# Altium schematic sheet GD2.SchDoc
size A2; SheetNumber: 1; SheetTotal: 1
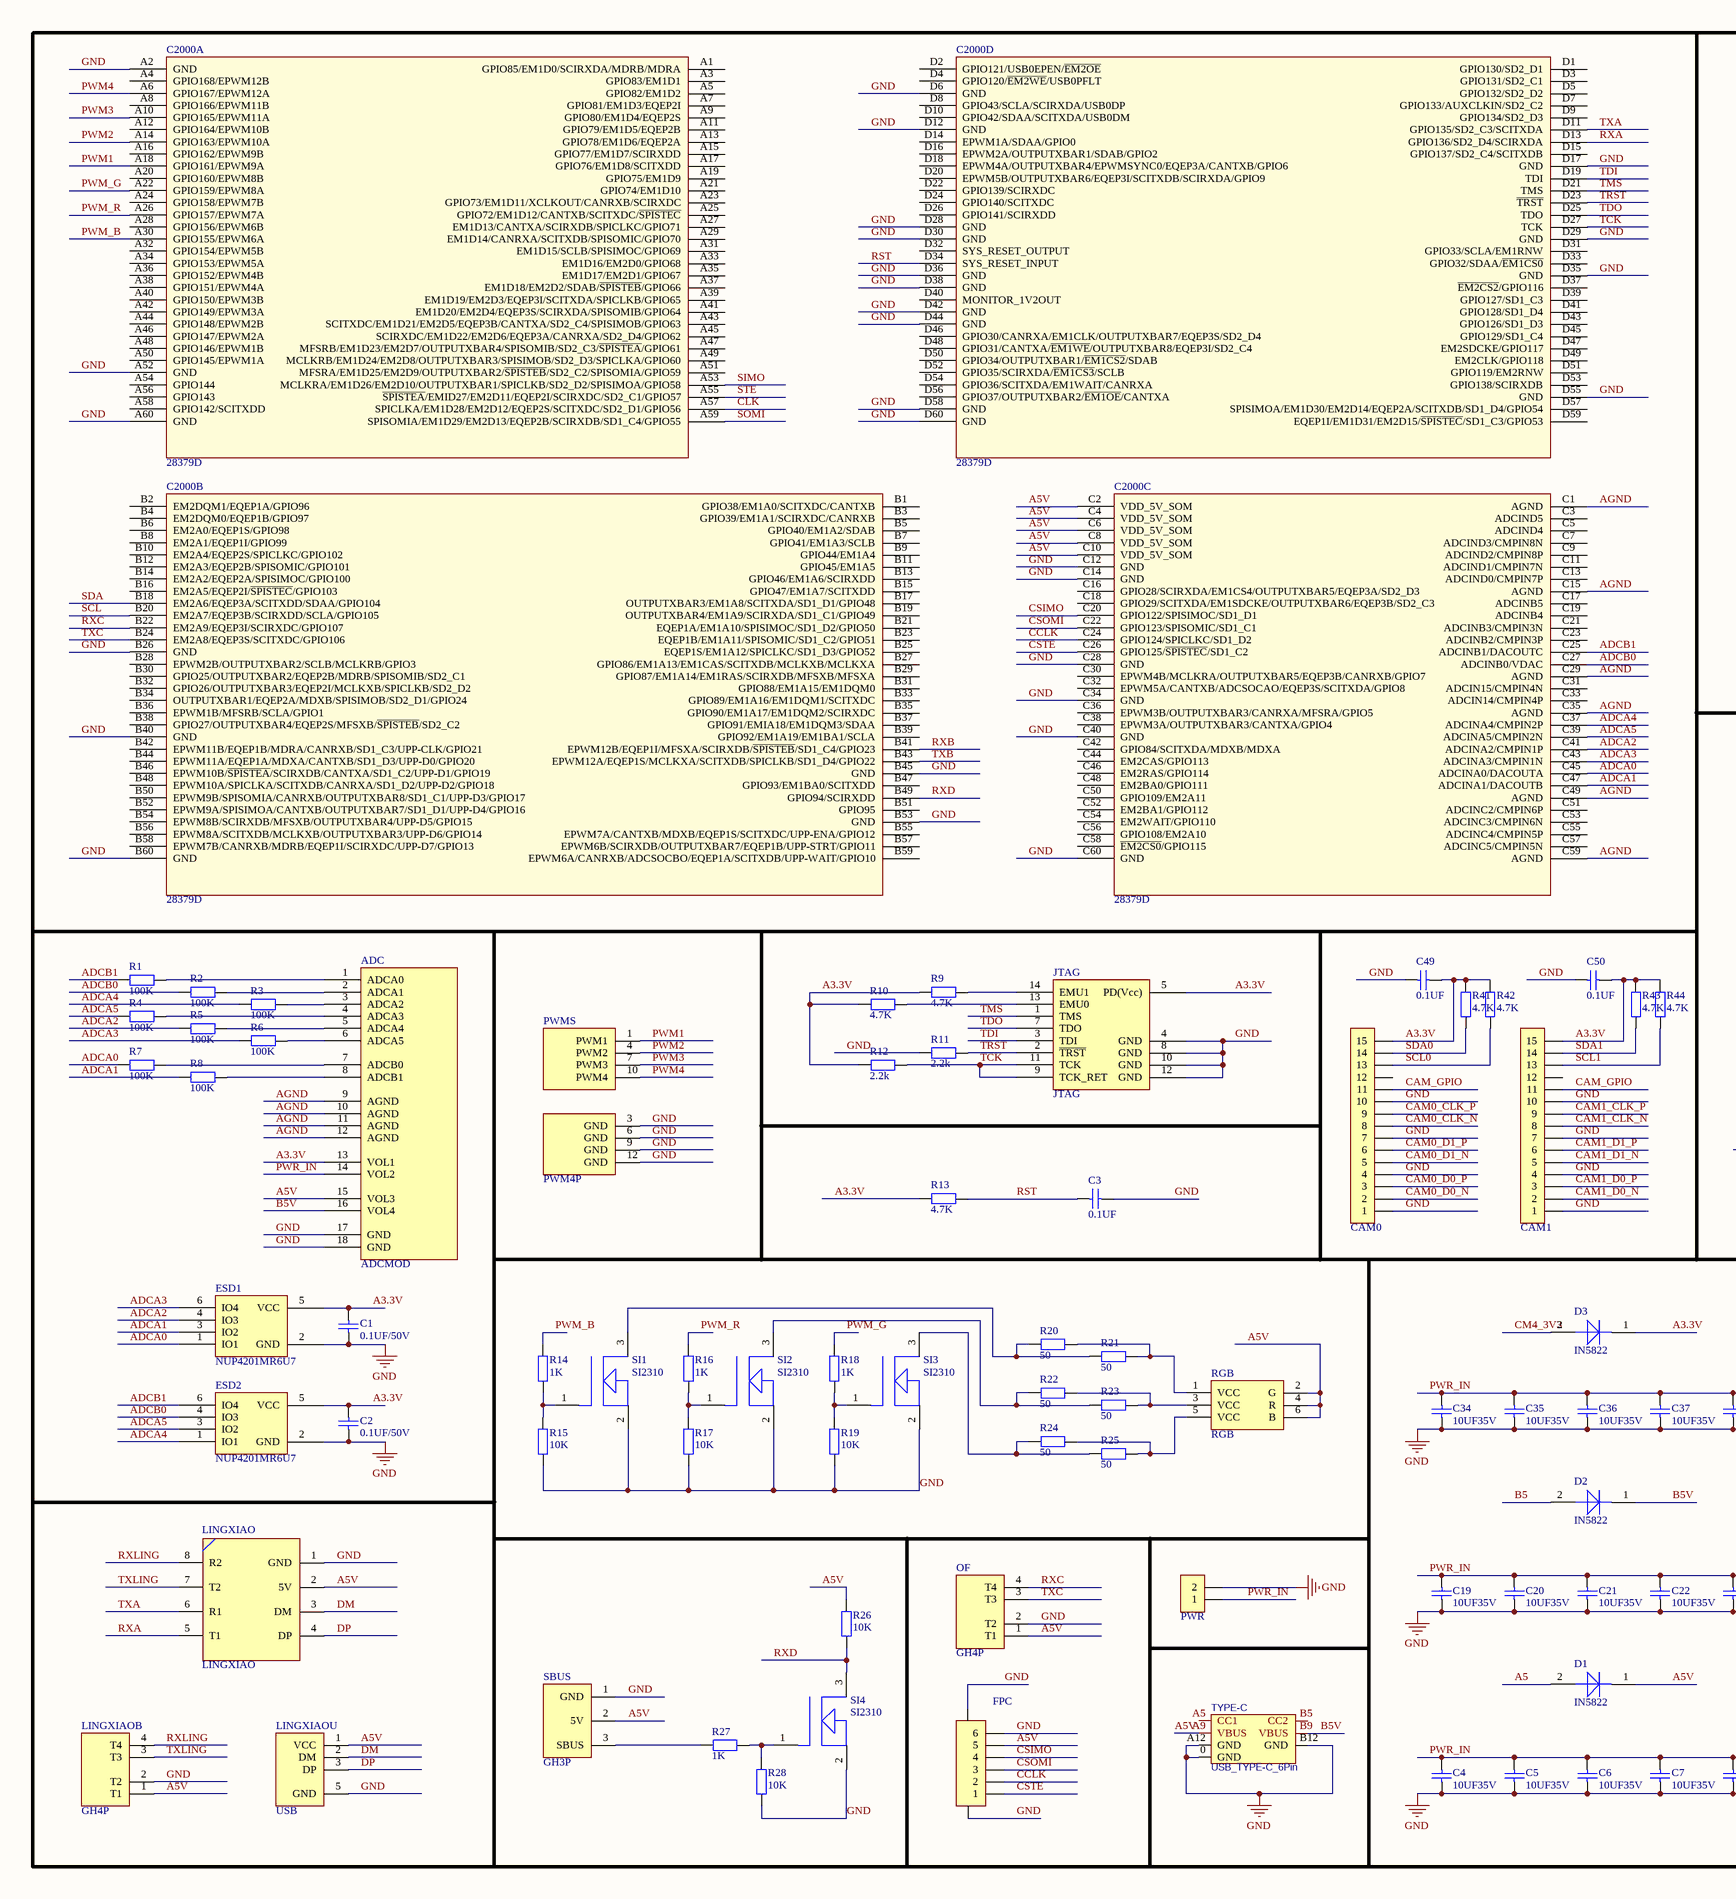
[diagram p0: GD2.SchDoc, left]
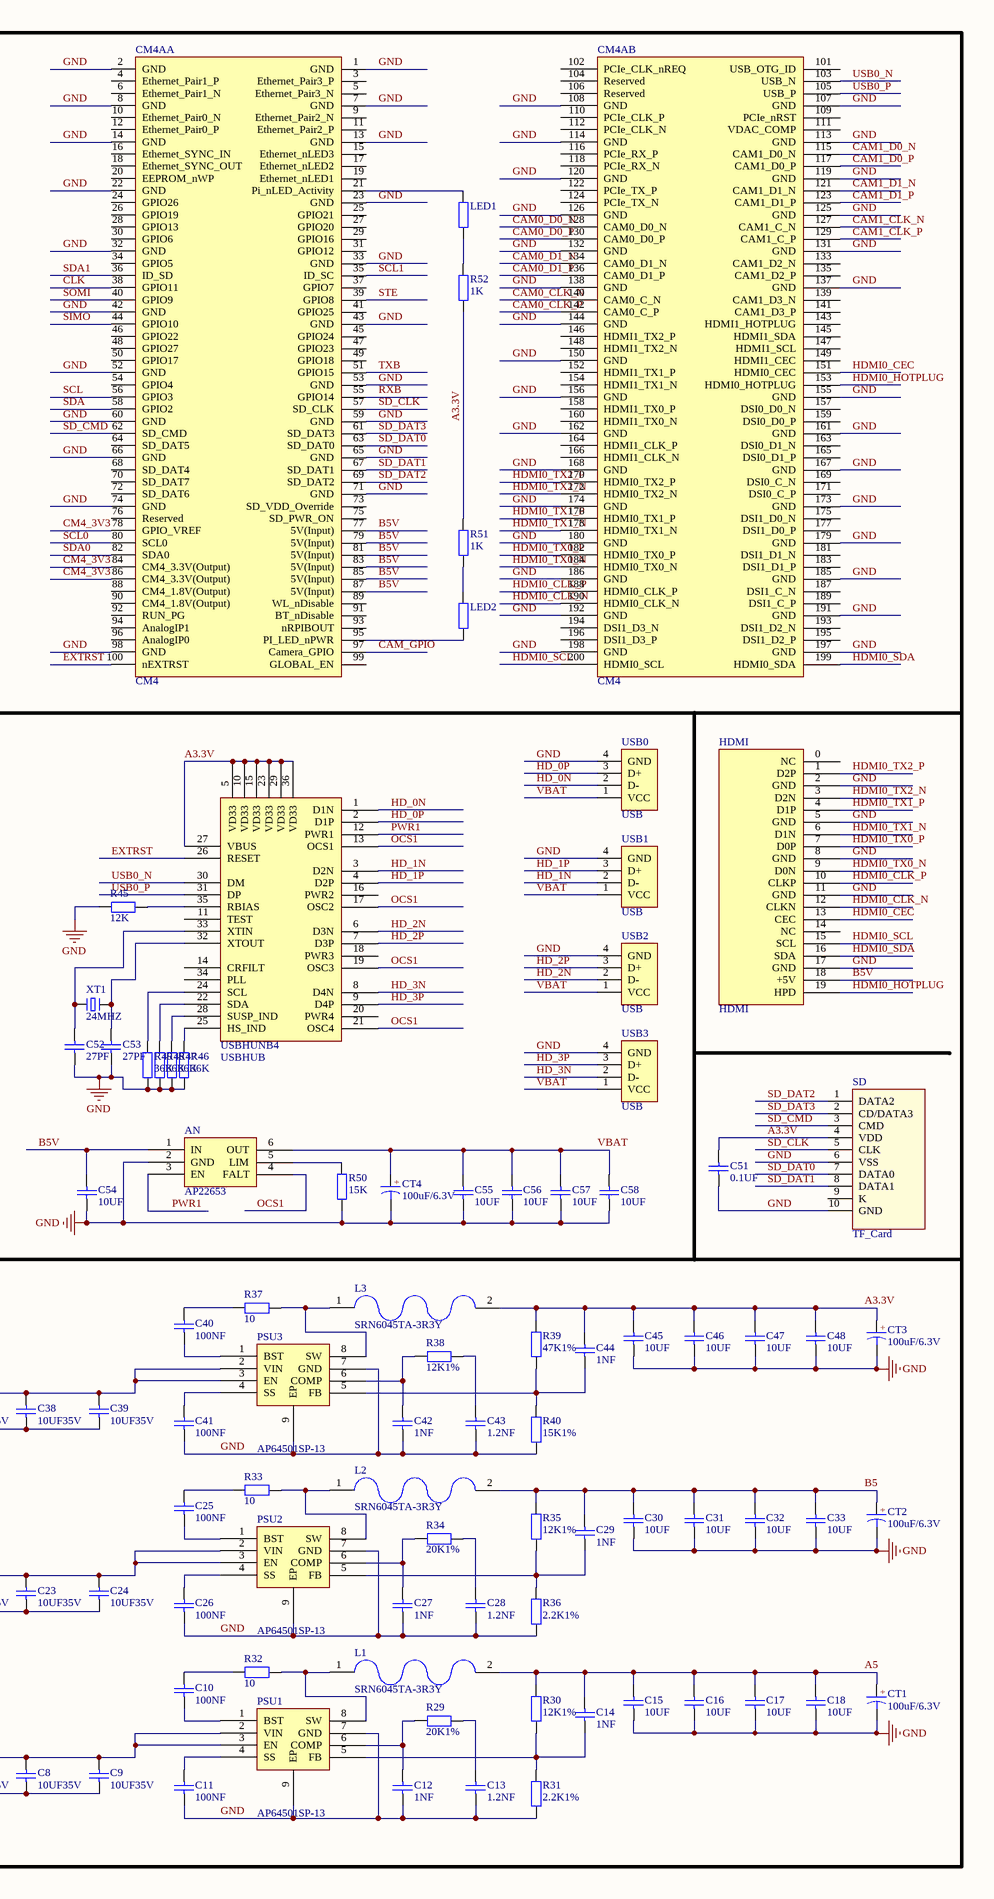
[diagram p1: GD2.SchDoc, right]

## Parts
ADC  ADCMOD  [ADCMOD]
AN  AP22653  [SOT23-6]
C1  0.1UF/50V  [C0603_L]
C2  0.1UF/50V  [C0603_L]
C3  0.1UF  [C0603_L]
C4  10UF35V  [C0603_L]
C5  10UF35V  [C0603_L]
C6  10UF35V  [C0603_L]
C7  10UF35V  [C0603_L]
C8  10UF35V  [C0603_L]
C9  10UF35V  [C0603_L]
C10  100NF  [C0603_L]
C11  100NF  [C0603_L]
C12  1NF  [C0603_L]
C13  1.2NF  [C0603_L]
C14  1NF  [C0603_L]
C15  10UF  [C0603_L]
C16  10UF  [C0603_L]
C17  10UF  [C0603_L]
C18  10UF  [C0603_L]
C19  10UF35V  [C0603_L]
C20  10UF35V  [C0603_L]
C21  10UF35V  [C0603_L]
C22  10UF35V  [C0603_L]
C23  10UF35V  [C0603_L]
C24  10UF35V  [C0603_L]
C25  100NF  [C0603_L]
C26  100NF  [C0603_L]
C27  1NF  [C0603_L]
C28  1.2NF  [C0603_L]
C29  1NF  [C0603_L]
C30  10UF  [C0603_L]
C31  10UF  [C0603_L]
C32  10UF  [C0603_L]
C33  10UF  [C0603_L]
C34  10UF35V  [C0603_L]
C35  10UF35V  [C0603_L]
C36  10UF35V  [C0603_L]
C37  10UF35V  [C0603_L]
C38  10UF35V  [C0603_L]
C39  10UF35V  [C0603_L]
C40  100NF  [C0603_L]
C41  100NF  [C0603_L]
C42  1NF  [C0603_L]
C43  1.2NF  [C0603_L]
C44  1NF  [C0603_L]
C45  10UF  [C0603_L]
C46  10UF  [C0603_L]
C47  10UF  [C0603_L]
C48  10UF  [C0603_L]
C49  0.1UF  [C0603_L]
C50  0.1UF  [C0603_L]
C51  0.1UF  [C0603_L]
C52  27PF  [C0603_L]
C53  27PF  [C0603_L]
C54  10UF  [C0603_L]
C55  10UF  [C0603_L]
C56  10UF  [C0603_L]
C57  10UF  [C0603_L]
C58  10UF  [C0603_L]
C2000  28379D  [28379D]  (parts A,B,C,D of 4)
CAM0  CON-15P  [FPC1.0-WT-15P]  (value not drawn)
CAM1  CON-15P  [FPC1.0-WT-15P]  (value not drawn)
CM4A  CM4  [CM4]  (parts A,B of 2)
CT1  100uF/6.3V  [C_3216]
CT2  100uF/6.3V  [C_3216]
CT3  100uF/6.3V  [C_3216]
CT4  100uF/6.3V  [C_3216]
D1  IN5822  [IN5819]
D2  IN5822  [IN5819]
D3  IN5822  [IN5819]
ESD1  NUP4201MR6U7  [TSOP-6]
ESD2  NUP4201MR6U7  [TSOP-6]
FPC  CON-6P  [FPC1.0-WT-6P]  (value not drawn)
HDMI  HDMI  [HDMI_A]
JTAG  JTAG  [JTAG]
L1  SRN6045TA-3R3Y  [CD42]
L2  SRN6045TA-3R3Y  [CD42]
L3  SRN6045TA-3R3Y  [CD42]
LED1  (no value)  [R0805_L]
LED2  (no value)  [R0805_L]
LINGXIAO  LINGXIAO  [LINGXIAO]
LINGXIAOB  GH4P  [GH4P]
LINGXIAOU  USB  [USB]
OF  GH4P  [GH4P]
PSU1  AP64501SP-13  [SOIP-8]
PSU2  AP64501SP-13  [SOIP-8]
PSU3  AP64501SP-13  [SOIP-8]
PWMS  PWM4P  [PWM4P]
PWR  HDR-1X2  [KF2EDGK5.08-WI-2P]  (value not drawn)
R1  100K  [R0603_L]
R2  100K  [R0603_L]
R3  100K  [R0603_L]
R4  100K  [R0603_L]
R5  100K  [R0603_L]
R6  100K  [R0603_L]
R7  100K  [R0603_L]
R8  100K  [R0603_L]
R9  4.7K  [R0603_L]
R10  4.7K  [R0603_L]
R11  2.2k  [R0603_L]
R12  2.2k  [R0603_L]
R13  4.7K  [R0603_L]
R14  1K  [R0603_L]
R15  10K  [R0603_L]
R16  1K  [R0603_L]
R17  10K  [R0603_L]
R18  1K  [R0603_L]
R19  10K  [R0603_L]
R20  50  [R0603_L]
R21  50  [R0603_L]
R22  50  [R0603_L]
R23  50  [R0603_L]
R24  50  [R0603_L]
R25  50  [R0603_L]
R26  10K  [R0603_L]
R27  1K  [R0603_L]
R28  10K  [R0603_L]
R29  20K1%  [R0603_L]
R30  12K1%  [R0603_L]
R31  2.2K1%  [R0603_L]
R32  10  [R0603_L]
R33  10  [R0603_L]
R34  20K1%  [R0603_L]
R35  12K1%  [R0603_L]
R36  2.2K1%  [R0603_L]
R37  10  [R0603_L]
R38  12K1%  [R0603_L]
R39  47K1%  [R0603_L]
R40  15K1%  [R0603_L]
R41  4.7K  [R0603_L]
R42  4.7K  [R0603_L]
R43  4.7K  [R0603_L]
R44  4.7K  [R0603_L]
R45  12K  [R0603_L]
R46  36K  [R0603_L]
R47  36K  [R0603_L]
R48  36K  [R0603_L]
R49  36K  [R0603_L]
R50  15K  [R0603_L]
R51  1K  [R0603_L]
R52  1K  [R0603_L]
RGB  RGB  [RGB]
SBUS  GH3P  [GH3P]
SD  TF_Card  [Micro SD]
SI1  SI2310  [SI2310]
SI2  SI2310  [SI2310]
SI3  SI2310  [SI2310]
SI4  SI2310  [SI2310]
TYPE-C  USB_TYPE-C_6Pin  [USB-C-SMD_6P]
USB0  USB  [USB2.0_Type-A_DIP_F_1]
USB1  USB  [USB2.0_Type-A_DIP_F_1]
USB2  USB  [USB2.0_Type-A_DIP_F_1]
USB3  USB  [USB2.0_Type-A_DIP_F_1]
USBHUNB4  USBHUB  [QFN36]
XT1  24MHZ  [XTAL-5032-2P]

## Nets
GND: ADC.17(GND) ADC.18(GND) AN.2(GND) C1.1 C2.1 C3.1 C4.1 C5.1 C6.1 C7.1 C8.1 C9.1 C11.1 C12.1 C13.1 C15.1 C16.1 C17.1 C18.1 C19.1 C20.1 C21.1 C22.1 C23.1 C24.1 C26.1 C27.1 C28.1 C30.1 C31.1 C32.1 C33.1 C34.1 C35.1 C36.1 C37.1 C38.1 C39.1 C41.1 C42.1 C43.1 C45.1 C46.1 C47.1 C48.1 C49.2 C50.2 C51.1 C52.1 C53.1 C54.1 C55.1 C56.1 C57.1 C58.1 C2000.A2(GND) C2000.A52(GND) C2000.A60(GND) C2000.B26(GND) C2000.B40(GND) C2000.B45(GND) C2000.B53(GND) C2000.B60(GND) C2000.C12(GND) C2000.C14(GND) C2000.C28(GND) C2000.C34(GND) C2000.C40(GND) C2000.C60(GND) C2000.D6(GND) C2000.D12(GND) C2000.D17(GND) C2000.D28(GND) C2000.D29(GND) C2000.D30(GND) C2000.D35(GND) C2000.D36(GND) C2000.D38(GND) C2000.D42(GND) C2000.D44(GND) C2000.D55(GND) C2000.D58(GND) C2000.D60(GND) CAM0.1 CAM0.4 CAM0.7 CAM0.10 CAM1.1 CAM1.4 CAM1.7 CAM1.10 CM4A.1(GND) CM4A.2(GND) CM4A.7(GND) CM4A.8(GND) CM4A.13(GND) CM4A.14(GND) CM4A.22(GND) CM4A.23(GND) CM4A.32(GND) CM4A.33(GND) CM4A.42(GND) CM4A.43(GND) CM4A.52(GND) CM4A.53(GND) CM4A.59(GND) CM4A.60(GND) CM4A.65(GND) CM4A.66(GND) CM4A.71(GND) CM4A.74(GND) CM4A.98(GND) CM4A.107(GND) CM4A.108(GND) CM4A.113(GND) CM4A.114(GND) CM4A.119(GND) CM4A.120(GND) CM4A.125(GND) CM4A.126(GND) CM4A.131(GND) CM4A.132(GND) CM4A.137(GND) CM4A.138(GND) CM4A.144(GND) CM4A.150(GND) CM4A.155(GND) CM4A.156(GND) CM4A.161(GND) CM4A.162(GND) CM4A.167(GND) CM4A.168(GND) CM4A.173(GND) CM4A.174(GND) CM4A.179(GND) CM4A.180(GND) CM4A.185(GND) CM4A.186(GND) CM4A.191(GND) CM4A.192(GND) CM4A.197(GND) CM4A.198(GND) CT1.2(K) CT2.2(K) CT3.2(K) CT4.2(K) ESD1.2(GND) ESD2.2(GND) FPC.0 FPC.6 HDMI.2(GND) HDMI.5(GND) HDMI.8(GND) HDMI.11(GND) HDMI.17(GND) JTAG.4(GND) JTAG.8(GND) JTAG.10(GND) JTAG.12(GND) LINGXIAO.1(GND) LINGXIAOB.2(T2) LINGXIAOU.5(GND) OF.2(T2) PSU1.7(GND) PSU1.9(EP) PSU2.7(GND) PSU2.9(EP) PSU3.7(GND) PSU3.9(EP) PWMS.3(GND) PWMS.6(GND) PWMS.9(GND) PWMS.12(GND) PWR.2 R11.1 R15.1 R17.1 R19.1 R28.2 R31.1 R36.1 R40.1 R45.1 R46.1 R47.1 R48.1 R49.1 R50.1 SBUS.1(GND) SD.6(VSS) SD.10(GND) SI1.2(B) SI2.2(B) SI3.2(B) SI4.2(B) TYPE-C.0(GND) TYPE-C.A12(GND) TYPE-C.B12(GND) USB0.4(GND) USB1.4(GND) USB2.4(GND) USB3.4(GND)
A3.3V: ADC.13(VOL1) C1.2 C2.2 C44.2 C45.2 C46.2 C47.2 C48.2 C49.1 C50.1 C51.2 CAM0.15 CAM1.15 CT3.1(A) D3.1(T1) ESD1.5(VCC) ESD2.5(VCC) JTAG.5(PD(Vcc)) L3.2(T3) R9.1 R10.1 R12.1 R13.2 R39.2 R41.2 R42.2 R43.2 R44.2 R51.2 R52.1 SD.4(VDD) USBHUNB4.5(VD33) USBHUNB4.10(VD33) USBHUNB4.15(VD33) USBHUNB4.23(VD33) USBHUNB4.27(VBUS) USBHUNB4.29(VD33) USBHUNB4.36(VD33)
A5: C14.2 C15.2 C16.2 C17.2 C18.2 CT1.1(A) D1.2(T2) L1.2(T3) R30.2
A5V: ADC.15(VOL3) C2000.C2(VDD_5V_SOM) C2000.C4(VDD_5V_SOM) C2000.C6(VDD_5V_SOM) C2000.C8(VDD_5V_SOM) C2000.C10(VDD_5V_SOM) D1.1(T1) FPC.5 LINGXIAO.2(5V) LINGXIAOB.1(T1) LINGXIAOU.1(VCC) OF.1(T1) R26.2 RGB.2(G) RGB.4(R) RGB.6(B) SBUS.2(5V) TYPE-C.A9(VBUS)
ADCA0: C2000.C45(ADCINA0/DACOUTA) ESD1.1(IO1) R7.1
ADCA1: C2000.C47(ADCINA1/DACOUTB) ESD1.3(IO2) R8.1
ADCA2: C2000.C41(ADCINA2/CMPIN1P) ESD1.4(IO3) R5.1
ADCA3: C2000.C43(ADCINA3/CMPIN1N) ESD1.6(IO4) R6.1
ADCA4: C2000.C37(ADCINA4/CMPIN2P) ESD2.1(IO1) R3.1
ADCA5: C2000.C39(ADCINA5/CMPIN2N) ESD2.3(IO2) R4.1
ADCB0: C2000.C27(ADCINB0/VDAC) ESD2.4(IO3) R2.1
ADCB1: C2000.C25(ADCINB1/DACOUTC) ESD2.6(IO4) R1.1
AGND: ADC.9(AGND) ADC.10(AGND) ADC.11(AGND) ADC.12(AGND) C2000.C1(AGND) C2000.C15(AGND) C2000.C29(AGND) C2000.C35(AGND) C2000.C49(AGND) C2000.C59(AGND)
B5: C29.2 C30.2 C31.2 C32.2 C33.2 CT2.1(A) D2.2(T2) L2.2(T3) R35.2
B5V: ADC.16(VOL4) AN.1(IN) C54.2 CM4A.77(5V(Input)) CM4A.79(5V(Input)) CM4A.81(5V(Input)) CM4A.83(5V(Input)) CM4A.85(5V(Input)) CM4A.87(5V(Input)) D2.1(T1) HDMI.18(+5V) TYPE-C.B9(VBUS)
CAM0_CLK_N: CAM0.8 CM4A.140(CAM0_C_N)
CAM0_CLK_P: CAM0.9 CM4A.142(CAM0_C_P)
CAM0_D0_N: CAM0.2 CM4A.128(CAM0_D0_N)
CAM0_D0_P: CAM0.3 CM4A.130(CAM0_D0_P)
CAM0_D1_N: CAM0.5 CM4A.134(CAM0_D1_N)
CAM0_D1_P: CAM0.6 CM4A.136(CAM0_D1_P)
CAM1_CLK_N: CAM1.8 CM4A.127(CAM1_C_N)
CAM1_CLK_P: CAM1.9 CM4A.129(CAM1_C_P)
CAM1_D0_N: CAM1.2 CM4A.115(CAM1_D0_N)
CAM1_D0_P: CAM1.3 CM4A.117(CAM1_D0_P)
CAM1_D1_N: CAM1.5 CM4A.121(CAM1_D1_N)
CAM1_D1_P: CAM1.6 CM4A.123(CAM1_D1_P)
CAM_GPIO: CAM0.11 CAM1.11 CM4A.97(Camera_GPIO)
CCLK: C2000.C24(GPIO124/SPICLKC/SD1_D2) FPC.2
CLK: C2000.A57(SPICLKA/EM1D28/EM2D12/EQEP2S/SCITXDC/SD2_D1/GPIO56) CM4A.38(GPIO11)
CM4_3V3: CM4A.78(GPIO_VREF) CM4A.84(CM4_3.3V(Output)) CM4A.86(CM4_3.3V(Output)) D3.2(T2)
CSIMO: C2000.C20(GPIO122/SPISIMOC/SD1_D1) FPC.4
CSOMI: C2000.C22(GPIO123/SPISOMIC/SD1_C1) FPC.3
CSTE: C2000.C26(GPIO125/~{SPISTEC}/SD1_C2) FPC.1
DM: LINGXIAO.3(DM) LINGXIAOU.2(DM)
DP: LINGXIAO.4(DP) LINGXIAOU.3(DP)
EXTRST: CM4A.100(nEXTRST) USBHUNB4.26(RESET)
HD_0N: USB0.2(D-) USBHUNB4.1(D1N)
HD_0P: USB0.3(D+) USBHUNB4.2(D1P)
HD_1N: USB1.2(D-) USBHUNB4.3(D2N)
HD_1P: USB1.3(D+) USBHUNB4.4(D2P)
HD_2N: USB2.2(D-) USBHUNB4.6(D3N)
HD_2P: USB2.3(D+) USBHUNB4.7(D3P)
HD_3N: USB3.2(D-) USBHUNB4.8(D4N)
HD_3P: USB3.3(D+) USBHUNB4.9(D4P)
HDMI0_CEC: CM4A.151(HDMI0_CEC) HDMI.13(CEC)
HDMI0_CLK_N: CM4A.190(HDMI0_CLK_N) HDMI.12(CLKN)
HDMI0_CLK_P: CM4A.188(HDMI0_CLK_P) HDMI.10(CLKP)
HDMI0_HOTPLUG: CM4A.153(HDMI0_HOTPLUG) HDMI.19(HPD)
HDMI0_SCL: CM4A.200(HDMI0_SCL) HDMI.15(SCL)
HDMI0_SDA: CM4A.199(HDMI0_SDA) HDMI.16(SDA)
HDMI0_TX0_N: CM4A.184(HDMI0_TX0_N) HDMI.9(D0N)
HDMI0_TX0_P: CM4A.182(HDMI0_TX0_P) HDMI.7(D0P)
HDMI0_TX1_N: CM4A.178(HDMI0_TX1_N) HDMI.6(D1N)
HDMI0_TX1_P: CM4A.176(HDMI0_TX1_P) HDMI.4(D1P)
HDMI0_TX2_N: CM4A.172(HDMI0_TX2_N) HDMI.3(D2N)
HDMI0_TX2_P: CM4A.170(HDMI0_TX2_P) HDMI.1(D2P)
OCS1: AN.4(FALT) USBHUNB4.13(OCS1) USBHUNB4.17(OSC2) USBHUNB4.19(OSC3) USBHUNB4.21(OSC4)
PWM1: C2000.A18(GPIO161/EPWM9A) PWMS.1(PWM1)
PWM2: C2000.A14(GPIO163/EPWM10A) PWMS.4(PWM2)
PWM3: C2000.A10(GPIO165/EPWM11A) PWMS.7(PWM3)
PWM4: C2000.A6(GPIO167/EPWM12A) PWMS.10(PWM4)
PWM_B: C2000.A30(GPIO155/EPWM6A) R14.2
PWM_G: C2000.A22(GPIO159/EPWM8A) R18.2
PWM_R: C2000.A26(GPIO157/EPWM7A) R16.2
PWR1: AN.3(EN) USBHUNB4.12(PWR1)
PWR_IN: ADC.14(VOL2) C4.2 C5.2 C6.2 C7.2 C8.2 C9.2 C19.2 C20.2 C21.2 C22.2 C23.2 C24.2 C34.2 C35.2 C36.2 C37.2 C38.2 C39.2 PSU1.2(VIN) PSU1.3(EN) PSU2.2(VIN) PSU2.3(EN) PSU3.2(VIN) PSU3.3(EN) PWR.1
RST: C3.2 C2000.D34(SYS_RESET_INPUT) R13.1
RXA: C2000.D13(GPIO136/SD2_D4/SCIRXDA) LINGXIAO.5(T1)
RXB: C2000.B41(EPWM12B/EQEP1I/MFSXA/SCIRXDB/~{SPISTEB}/SD1_C4/GPIO23) CM4A.55(GPIO14)
RXC: C2000.B22(EM2A9/EQEP3I/SCIRXDC/GPIO107) OF.4(T4)
RXD: C2000.B49(GPIO94/SCIRXDD) R26.1 SI4.3(B)
RXLING: LINGXIAO.8(R2) LINGXIAOB.4(T4)
SCL: C2000.B20(EM2A7/EQEP3B/SCIRXDD/SCLA/GPIO105) CM4A.56(GPIO3)
SCL0: CAM0.13 CM4A.80(SCL0) R42.1
SCL1: CAM1.13 CM4A.35(ID_SC) R44.1
SD_CLK: CM4A.57(SD_CLK) SD.5(CLK)
SD_CMD: CM4A.62(SD_CMD) SD.3(CMD)
SD_DAT0: CM4A.63(SD_DAT0) SD.7(DATA0)
SD_DAT1: CM4A.67(SD_DAT1) SD.8(DATA1)
SD_DAT2: CM4A.69(SD_DAT2) SD.1(DATA2)
SD_DAT3: CM4A.61(SD_DAT3) SD.2(CD/DATA3)
SDA: C2000.B18(EM2A6/EQEP3A/SCITXDD/SDAA/GPIO104) CM4A.58(GPIO2)
SDA0: CAM0.14 CM4A.82(SDA0) R41.1
SDA1: CAM1.14 CM4A.36(ID_SD) R43.1
SIMO: C2000.A53(MCLKRA/EM1D26/EM2D10/OUTPUTXBAR1/SPICLKB/SD2_D2/SPISIMOA/GPIO58) CM4A.44(GPIO10)
SOMI: C2000.A59(SPISOMIA/EM1D29/EM2D13/EQEP2B/SCIRXDB/SD1_C4/GPIO55) CM4A.40(GPIO9)
STE: C2000.A55(~{SPISTEA}/EMID27/EM2D11/EQEP2I/SCIRXDC/SD2_C1/GPIO57) CM4A.39(GPIO8)
TCK: C2000.D27(TCK) JTAG.9(TCK_RET) JTAG.11(TCK) R12.2
TDI: C2000.D19(TDI) JTAG.3(TDI)
TDO: C2000.D25(TDO) JTAG.7(TDO)
TMS: C2000.D21(TMS) JTAG.1(TMS)
TRST: C2000.D23(~{TRST}) JTAG.2(~{TRST}) R11.2
TXA: C2000.D11(GPIO135/SD2_C3/SCITXDA) LINGXIAO.6(R1)
TXB: C2000.B43(EPWM12A/EQEP1S/MCLKXA/SCITXDB/SPICLKB/SD1_D4/GPIO22) CM4A.51(GPIO15)
TXC: C2000.B24(EM2A8/EQEP3S/SCITXDC/GPIO106) OF.3(T3)
TXLING: LINGXIAO.7(T2) LINGXIAOB.3(T3)
USB0_N: CM4A.103(USB_N) USBHUNB4.30(DM)
USB0_P: CM4A.105(USB_P) USBHUNB4.31(DP)
VBAT: AN.6(OUT) C55.2 C56.2 C57.2 C58.2 CT4.1(A) USB0.1(VCC) USB1.1(VCC) USB2.1(VCC) USB3.1(VCC)
NetADC_1: ADC.1(ADCA0) R1.2
NetADC_2: ADC.2(ADCA1) R2.2
NetADC_3: ADC.3(ADCA2) R3.2
NetADC_4: ADC.4(ADCA3) R4.2
NetADC_5: ADC.5(ADCA4) R5.2
NetADC_6: ADC.6(ADCA5) R6.2
NetADC_7: ADC.7(ADCB0) R7.2
NetADC_8: ADC.8(ADCB1) R8.2
NetAN_5: AN.5(LIM) R50.2
NetC10_1: C10.1 PSU1.1(BST)
NetC10_2: C10.2 R32.1
NetC11_2: C11.2 PSU1.4(SS)
NetC12_2: C12.2 PSU1.6(COMP) R29.2
NetC13_2: C13.2 R29.1
NetC14_1: C14.1 PSU1.5(FB) R30.1 R31.2
NetC25_1: C25.1 PSU2.1(BST)
NetC25_2: C25.2 R33.1
NetC26_2: C26.2 PSU2.4(SS)
NetC27_2: C27.2 PSU2.6(COMP) R34.2
NetC28_2: C28.2 R34.1
NetC29_1: C29.1 PSU2.5(FB) R35.1 R36.2
NetC40_1: C40.1 PSU3.1(BST)
NetC40_2: C40.2 R37.1
NetC41_2: C41.2 PSU3.4(SS)
NetC42_2: C42.2 PSU3.6(COMP) R38.2
NetC43_2: C43.2 R38.1
NetC44_1: C44.1 PSU3.5(FB) R39.1 R40.2
NetC52_2: C52.2 USBHUNB4.33(XTIN) XT1.1
NetC53_2: C53.2 USBHUNB4.32(XTOUT) XT1.2
NetCM4A_21: CM4A.21(Pi_nLED_Activity) LED1.2
NetCM4A_95: CM4A.95(PI_LED_nPWR) LED2.1
NetJTAG_13: JTAG.13(EMU0) R10.2
NetJTAG_14: JTAG.14(EMU1) R9.2
NetL1_1: L1.1(T4) PSU1.8(SW) R32.2
NetL2_1: L2.1(T4) PSU2.8(SW) R33.2
NetL3_1: L3.1(T4) PSU3.8(SW) R37.2
NetLED1_1: LED1.1 R52.2
NetLED2_2: LED2.2 R51.1
NetR14_1: R14.1 R15.2 SI1.1(B)
NetR16_1: R16.1 R17.2 SI2.1(B)
NetR18_1: R18.1 R19.2 SI3.1(B)
NetR20_1: R20.1 R21.1 RGB.1(VCC)
NetR20_2: R20.2 R21.2 SI1.3(B)
NetR22_1: R22.1 R23.1 RGB.3(VCC)
NetR22_2: R22.2 R23.2 SI2.3(B)
NetR24_1: R24.1 R25.1 RGB.5(VCC)
NetR24_2: R24.2 R25.2 SI3.3(B)
NetR27_1: R27.1 R28.1 SI4.1(B)
NetR27_2: R27.2 SBUS.3(SBUS)
NetR45_2: R45.2 USBHUNB4.35(RBIAS)
NetR46_2: R46.2 USBHUNB4.25(HS_IND)
NetR47_2: R47.2 USBHUNB4.28(SUSP_IND)
NetR48_2: R48.2 USBHUNB4.22(SDA)
NetR49_2: R49.2 USBHUNB4.24(SCL)

Not connected (* = marked no-connect by the designer): C2000 A1(GPIO85/EM1D0/SCIRXDA/MDRB/MDRA) A3(GPIO83/EM1D1) A4(GPIO168/EPWM12B) A5(GPIO82/EM1D2) A7(GPIO81/EM1D3/EQEP2I) A8(GPIO166/EPWM11B) A9(GPIO80/EM1D4/EQEP2S) A11(GPIO79/EM1D5/EQEP2B) A12(GPIO164/EPWM10B) A13(GPIO78/EM1D6/EQEP2A) A15(GPIO77/EM1D7/SCIRXDD) A16(GPIO162/EPWM9B) A17(GPIO76/EM1D8/SCITXDD) A19(GPIO75/EM1D9) A20(GPIO160/EPWM8B) A21(GPIO74/EM1D10) A23(GPIO73/EM1D11/XCLKOUT/CANRXB/SCIRXDC) A24(GPIO158/EPWM7B) A25(GPIO72/EM1D12/CANTXB/SCITXDC/~{SPISTEC}) A27(EM1D13/CANTXA/SCIRXDB/SPICLKC/GPIO71) A28(GPIO156/EPWM6B) A29(EM1D14/CANRXA/SCITXDB/SPISOMIC/GPIO70) A31(EM1D15/SCLB/SPISIMOC/GPIO69) A32(GPIO154/EPWM5B) A33(EM1D16/EM2D0/GPIO68) A34(GPIO153/EPWM5A) A35(EM1D17/EM2D1/GPIO67) A36(GPIO152/EPWM4B) A37(EM1D18/EM2D2/SDAB/~{SPISTEB}/GPIO66) A38(GPIO151/EPWM4A) A39(EM1D19/EM2D3/EQEP3I/SCITXDA/SPICLKB/GPIO65) A40(GPIO150/EPWM3B) A41(EM1D20/EM2D4/EQEP3S/SCIRXDA/SPISOMIB/GPIO64) A42(GPIO149/EPWM3A) A43(SCITXDC/EM1D21/EM2D5/EQEP3B/CANTXA/SD2_C4/SPISIMOB/GPIO63) A44(GPIO148/EPWM2B) A45(SCIRXDC/EM1D22/EM2D6/EQEP3A/CANRXA/SD2_D4/GPIO62) A46(GPIO147/EPWM2A) A47(MFSRB/EM1D23/EM2D7/OUTPUTXBAR4/SPISOMIB/SD2_C3/~{SPISTEA}/GPIO61) A48(GPIO146/EPWM1B) A49(MCLKRB/EM1D24/EM2D8/OUTPUTXBAR3/SPISIMOB/SD2_D3/SPICLKA/GPIO60) A50(GPIO145/EPWM1A) A51(MFSRA/EM1D25/EM2D9/OUTPUTXBAR2/~{SPISTEB}/SD2_C2/SPISOMIA/GPIO59) A54(GPIO144) A56(GPIO143) A58(GPIO142/SCITXDD) B1(GPIO38/EM1A0/SCITXDC/CANTXB) B2(EM2DQM1/EQEP1A/GPIO96) B3(GPIO39/EM1A1/SCIRXDC/CANRXB) B4(EM2DQM0/EQEP1B/GPIO97) B5(GPIO40/EM1A2/SDAB) B6(EM2A0/EQEP1S/GPIO98) B7(GPIO41/EM1A3/SCLB) B8(EM2A1/EQEP1I/GPIO99) B9(GPIO44/EM1A4) B10(EM2A4/EQEP2S/SPICLKC/GPIO102) B11(GPIO45/EM1A5) B12(EM2A3/EQEP2B/SPISOMIC/GPIO101) B13(GPIO46/EM1A6/SCIRXDD) B14(EM2A2/EQEP2A/SPISIMOC/GPIO100) B15(GPIO47/EM1A7/SCITXDD) B16(EM2A5/EQEP2I/~{SPISTEC}/GPIO103) B17(OUTPUTXBAR3/EM1A8/SCITXDA/SD1_D1/GPIO48) B19(OUTPUTXBAR4/EM1A9/SCIRXDA/SD1_C1/GPIO49) B21(EQEP1A/EM1A10/SPISIMOC/SD1_D2/GPIO50) B23(EQEP1B/EM1A11/SPISOMIC/SD1_C2/GPIO51) B25(EQEP1S/EM1A12/SPICLKC/SD1_D3/GPIO52) B27(GPIO86/EM1A13/EM1CAS/SCITXDB/MCLKXB/MCLKXA) B28(EPWM2B/OUTPUTXBAR2/SCLB/MCLKRB/GPIO3) B29(GPIO87/EM1A14/EM1RAS/SCIRXDB/MFSXB/MFSXA) B30(GPIO25/OUTPUTXBAR2/EQEP2B/MDRB/SPISOMIB/SD2_C1) B31(GPIO88/EM1A15/EM1DQM0) B32(GPIO26/OUTPUTXBAR3/EQEP2I/MCLKXB/SPICLKB/SD2_D2) B33(GPIO89/EM1A16/EM1DQM1/SCITXDC) B34(OUTPUTXBAR1/EQEP2A/MDXB/SPISIMOB/SD2_D1/GPIO24) B35(GPIO90/EM1A17/EM1DQM2/SCIRXDC) B36(EPWM1B/MFSRB/SCLA/GPIO1) B37(GPIO91/EMIA18/EM1DQM3/SDAA) B38(GPIO27/OUTPUTXBAR4/EQEP2S/MFSXB/~{SPISTEB}/SD2_C2) B39(GPIO92/EM1A19/EM1BA1/SCLA) B42(EPWM11B/EQEP1B/MDRA/CANRXB/SD1_C3/UPP-CLK/GPIO21) B44(EPWM11A/EQEP1A/MDXA/CANTXB/SD1_D3/UPP-D0/GPIO20) B46(EPWM10B/~{SPISTEA}/SCIRXDB/CANTXA/SD1_C2/UPP-D1/GPIO19) B47(GPIO93/EM1BA0/SCITXDD) B48(EPWM10A/SPICLKA/SCITXDB/CANRXA/SD1_D2/UPP-D2/GPIO18) B50(EPWM9B/SPISOMIA/CANRXB/OUTPUTXBAR8/SD1_C1/UPP-D3/GPIO17) B51(GPIO95) B52(EPWM9A/SPISIMOA/CANTXB/OUTPUTXBAR7/SD1_D1/UPP-D4/GPIO16) B54(EPWM8B/SCIRXDB/MFSXB/OUTPUTXBAR4/UPP-D5/GPIO15) B55(EPWM7A/CANTXB/MDXB/EQEP1S/SCITXDC/UPP-ENA/GPIO12) B56(EPWM8A/SCITXDB/MCLKXB/OUTPUTXBAR3/UPP-D6/GPIO14) B57(EPWM6B/SCIRXDB/OUTPUTXBAR7/EQEP1B/UPP-STRT/GPIO11) B58(EPWM7B/CANRXB/MDRB/EQEP1I/SCIRXDC/UPP-D7/GPIO13) B59(EPWM6A/CANRXB/ADCSOCBO/EQEP1A/SCITXDB/UPP-WAIT/GPIO10) C3(ADCIND5) C5(ADCIND4) C7(ADCIND3/CMPIN8N) C9(ADCIND2/CMPIN8P) C11(ADCIND1/CMPIN7N) C13(ADCIND0/CMPIN7P) C16(GPIO28/SCIRXDA/EM1CS4/OUTPUTXBAR5/EQEP3A/SD2_D3) C17(ADCINB5) C18(GPIO29/SCITXDA/EM1SDCKE/OUTPUTXBAR6/EQEP3B/SD2_C3) C19(ADCINB4) C21(ADCINB3/CMPIN3N) C23(ADCINB2/CMPIN3P) C30(EPWM4B/MCLKRA/OUTPUTXBAR5/EQEP3B/CANRXB/GPIO7) C31(ADCIN15/CMPIN4N) C32(EPWM5A/CANTXB/ADCSOCAO/EQEP3S/SCITXDA/GPIO8) C33(ADCIN14/CMPIN4P) C36(EPWM3B/OUTPUTXBAR3/CANRXA/MFSRA/GPIO5) C38(EPWM3A/OUTPUTXBAR3/CANTXA/GPIO4) C42(GPIO84/SCITXDA/MDXB/MDXA) C44(EM2CAS/GPIO113) C46(EM2RAS/GPIO114) C48(EM2BA0/GPIO111) C50(GPIO109/EM2A11) C51(ADCINC2/CMPIN6P) C52(EM2BA1/GPIO112) C53(ADCINC3/CMPIN6N) C54(EM2WAIT/GPIO110) C55(ADCINC4/CMPIN5P) C56(GPIO108/EM2A10) C57(ADCINC5/CMPIN5N) C58(~{EM2CS0}/GPIO115) D1(GPIO130/SD2_D1) D2(GPIO121/USB0EPEN/~{EM2OE}) D3(GPIO131/SD2_C1) D4(GPIO120/~{EM2WE}/USB0PFLT) D5(GPIO132/SD2_D2) D7(GPIO133/AUXCLKIN/SD2_C2) D8(GPIO43/SCLA/SCIRXDA/USB0DP) D9(GPIO134/SD2_D3) D10(GPIO42/SDAA/SCITXDA/USB0DM) D14(EPWM1A/SDAA/GPIO0) D15(GPIO137/SD2_C4/SCITXDB) D16(EPWM2A/OUTPUTXBAR1/SDAB/GPIO2) D18(EPWM4A/OUTPUTXBAR4/EPWMSYNC0/EQEP3A/CANTXB/GPIO6) D20(EPWM5B/OUTPUTXBAR6/EQEP3I/SCITXDB/SCIRXDA/GPIO9) D22(GPIO139/SCIRXDC) D24(GPIO140/SCITXDC) D26(GPIO141/SCIRXDD) D31(GPIO33/SCLA/EM1RNW) D32(SYS_RESET_OUTPUT) D33(GPIO32/SDAA/~{EM1CS0}) D37(~{EM2CS2}/GPIO116) D39(GPIO127/SD1_C3) D40(MONITOR_1V2OUT) D41(GPIO128/SD1_D4) D43(GPIO126/SD1_D3) D45(GPIO129/SD1_C4) D46(GPIO30/CANRXA/EM1CLK/OUTPUTXBAR7/EQEP3S/SD2_D4) D47(EM2SDCKE/GPIO117) D48(GPIO31/CANTXA/~{EM1WE}/OUTPUTXBAR8/EQEP3I/SD2_C4) D49(EM2CLK/GPIO118) D50(GPIO34/OUTPUTXBAR1/~{EM1CS2}/SDAB) D51(GPIO119/EM2RNW) D52(GPIO35/SCIRXDA/~{EM1CS3}/SCLB) D53(GPIO138/SCIRXDB) D54(GPIO36/SCITXDA/EM1WAIT/CANRXA) D56(GPIO37/OUTPUTXBAR2/~{EM1OE}/CANTXA) D57(SPISIMOA/EM1D30/EM2D14/EQEP2A/SCITXDB/SD1_D4/GPIO54) D59(EQEP1I/EM1D31/EM2D15/~{SPISTEC}/SD1_C3/GPIO53); CAM0 12; CAM1 12; CM4A 3(Ethernet_Pair3_P) 4(Ethernet_Pair1_P) 5(Ethernet_Pair3_N) 6(Ethernet_Pair1_N) 9(Ethernet_Pair2_N) 10(Ethernet_Pair0_N) 11(Ethernet_Pair2_P) 12(Ethernet_Pair0_P) 15(Ethernet_nLED3) 16(Ethernet_SYNC_IN) 17(Ethernet_nLED2) 18(Ethernet_SYNC_OUT) 19(Ethernet_nLED1) 20(EEPROM_nWP) 24(GPIO26) 25(GPIO21) 26(GPIO19) 27(GPIO20) 28(GPIO13) 29(GPIO16) 30(GPIO6) 31(GPIO12) 34(GPIO5) 37(GPIO7) 41(GPIO25) 45(GPIO24) 46(GPIO22) 47(GPIO23) 48(GPIO27) 49(GPIO18) 50(GPIO17) 54(GPIO4) 64(SD_DAT5) 68(SD_DAT4) 70(SD_DAT7) 72(SD_DAT6) 73(SD_VDD_Override) 75(SD_PWR_ON) 76(Reserved) 88(CM4_1.8V(Output)) 89(WL_nDisable) 90(CM4_1.8V(Output)) 91(BT_nDisable) 92(RUN_PG) 93(nRPIBOUT) 94(AnalogIP1) 96(AnalogIP0) 99(GLOBAL_EN) 101(USB_OTG_ID) 102(PCIe_CLK_nREQ) 104(Reserved) 106(Reserved) 109(PCIe_nRST) 110(PCIe_CLK_P) 111(VDAC_COMP) 112(PCIe_CLK_N) 116(PCIe_RX_P) 118(PCIe_RX_N) 122(PCIe_TX_P) 124(PCIe_TX_N) 133(CAM1_D2_N) 135(CAM1_D2_P) 139(CAM1_D3_N) 141(CAM1_D3_P) 143(HDMI1_HOTPLUG) 145(HDMI1_SDA) 146(HDMI1_TX2_P) 147(HDMI1_SCL) 148(HDMI1_TX2_N) 149(HDMI1_CEC) 152(HDMI1_TX1_P) 154(HDMI1_TX1_N) 157(DSI0_D0_N) 158(HDMI1_TX0_P) 159(DSI0_D0_P) 160(HDMI1_TX0_N) 163(DSI0_D1_N) 164(HDMI1_CLK_P) 165(DSI0_D1_P) 166(HDMI1_CLK_N) 169(DSI0_C_N) 171(DSI0_C_P) 175(DSI1_D0_N) 177(DSI1_D0_P) 181(DSI1_D1_N) 183(DSI1_D1_P) 187(DSI1_C_N) 189(DSI1_C_P) 193(DSI1_D2_N) 194(DSI1_D3_N) 195(DSI1_D2_P) 196(DSI1_D3_P); HDMI 0(NC) 14(NC); SD 9(K); TYPE-C A5(CC1) B5(CC2); USBHUNB4 11(TEST) 14(CRFILT) 16(PWR2) 18(PWR3) 20(PWR4) 34(PLL)

## Notes on the sheet
- (in symbol CT) +

## Library data of the parts
C1-C58 = C: 贴片电容/MLCC电容; BOM名称: 无极性贴片电容; 联系卖家，免费查找封装: 唯一出售店铺网址https://shop463601444.taobao.com
CAM0 CAM1 = Header 15: 15P连接器; 联系卖家 免费查找封装: 唯一出售店铺网址https://shop463601444.taobao.com; 联系卖家 免费技术支持: 封装库来自淘宝卖家ID：黄晶宝石; BOM名称: 15P连接器
CT1-CT4 = CT: 贴片钽电容; 联系卖家，免费查找封装: 唯一出售店铺网址https://shop463601444.taobao.com; BOM名称: 贴片钽电容
D1-D3 = IN5819
FPC = Header 6: 6P连接器; 联系卖家 免费查找封装: 唯一出售店铺网址https://shop463601444.taobao.com; 联系卖家 免费技术支持: 封装库来自淘宝卖家ID：黄晶宝石; BOM名称: 6P连接器
LED1 LED2 R1-R52 = R: 贴片电阻; 联系卖家，免费查找封装: 唯一出售店铺网址https://shop463601444.taobao.com; BOM名称: 贴片电阻
PWR = Header 2: 2P接插件; 联系卖家，免费技术支持: 唯一出售店铺网址https://shop463601444.taobao.com; BOM名称: 2P接插件
SD = TF_Card: TF卡座; 联系卖家 免费技术支持: 封装库来自淘宝卖家ID：黄晶宝石; BOM名称: TF卡座
TYPE-C = USB_TYPE-C_6Pin: USB_TYPE-C_6Pin母座; 联系卖家 免费技术支持: 封装库来自淘宝卖家ID：黄晶宝石
USB0-USB3 = USB2.0_Type-A_F: USB2.0_Type-A母座; 联系卖家 免费技术支持: 封装库来自淘宝卖家ID：黄晶宝石; BOM名称: USB2.0_Type-A母座
XT1 = XTAL-2P: 2脚无源晶振(谐振器）; 联系卖家，免费查找封装: 唯一出售店铺网址https://shop463601444.taobao.com; BOM名称: 2脚无源晶振(谐振器）